# EAGLE design rolladen (EAGLE 6.3)
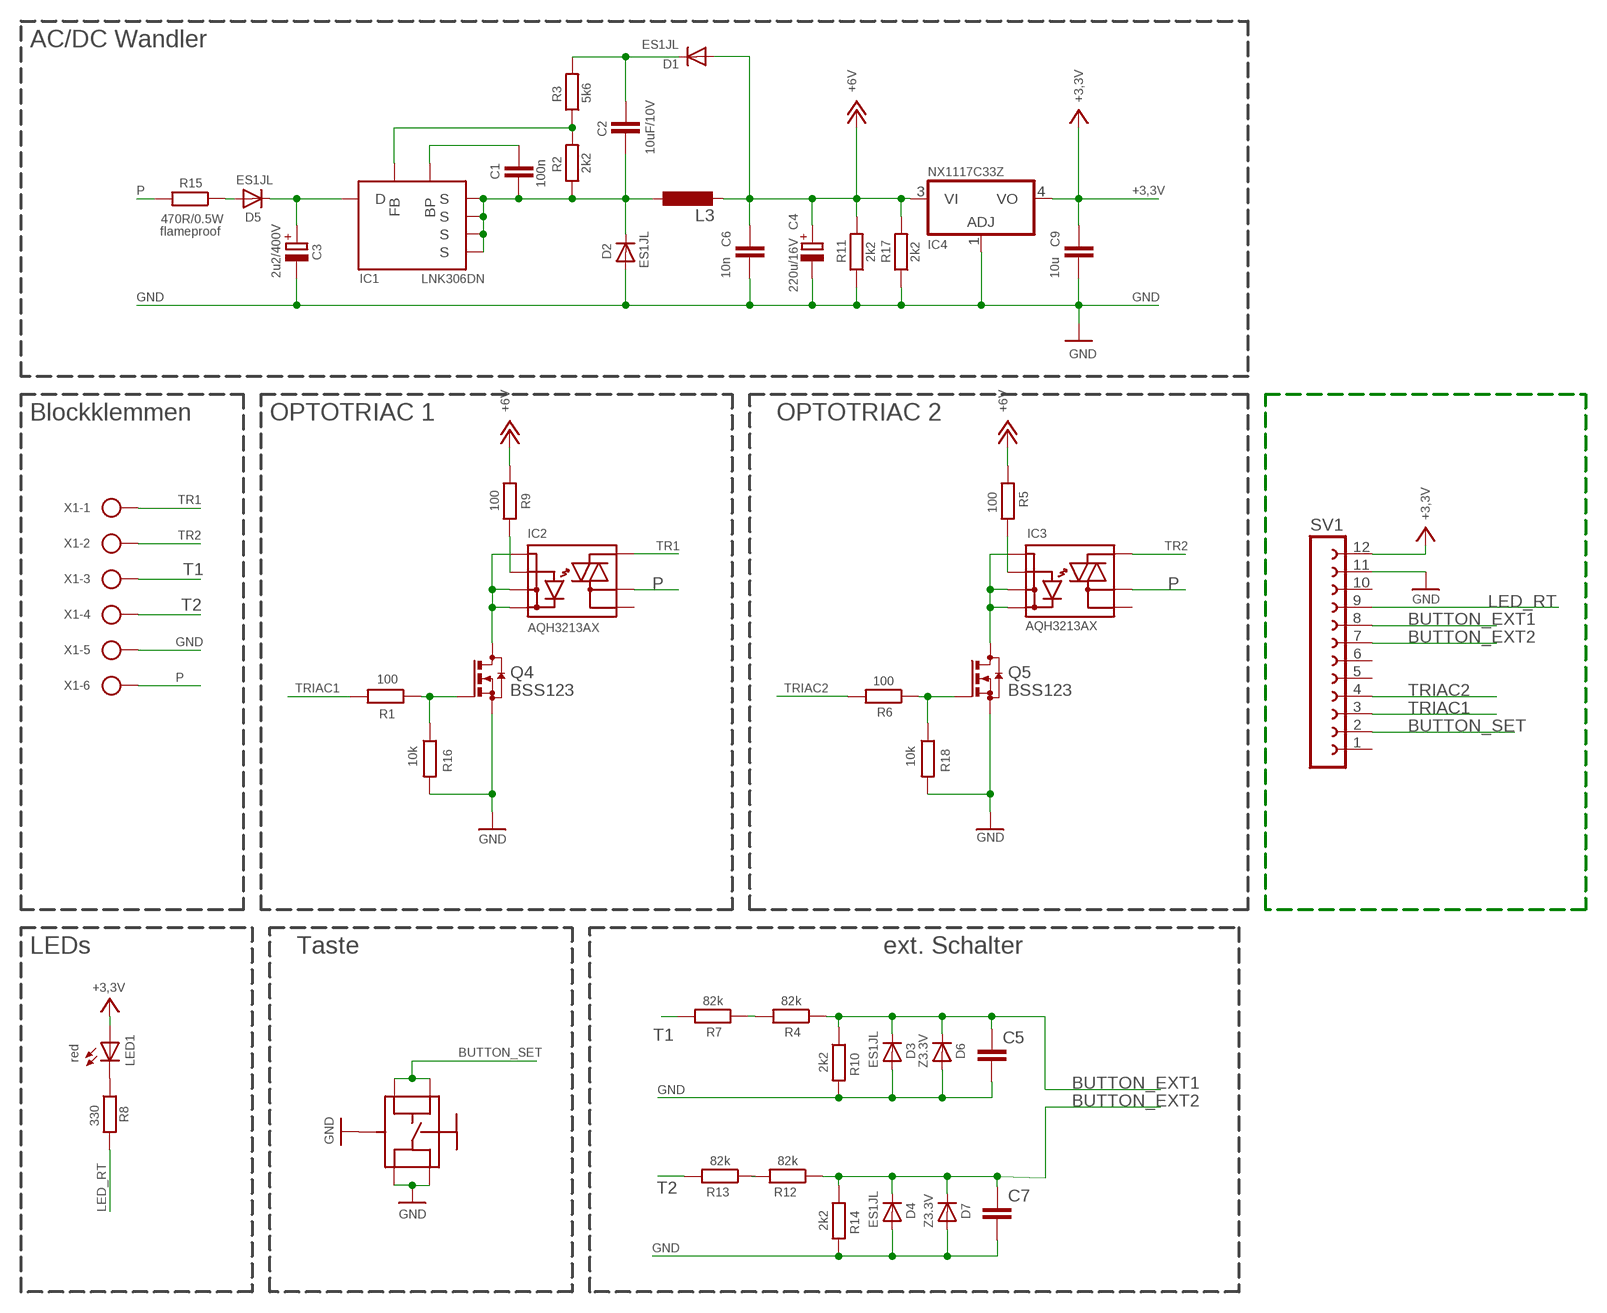
[diagram p0: schematic, sheet 1]

## Parts
C1  100n  C-EUC0603  [C0603]
C2  10uF/10V  C-EUC0805  [C0805]
C3  2u2/400V  CPOL-EUTT5D11L  [TT5D11L]
C4  220u/16V  CPOL-EU153CLV-0605  [153CLV-0605]
C5  C-EUC0603  [C0603]
C6  10n  C-EUC0603  [C0603]
C7  C-EUC0603  [C0603]
C9  10u  C-EUC0805  [C0805]
D1  ES1JL  DIODE-SOD323-W  [SOD323-W]
D2  ES1JL  DIODE-SOD323-W  [SOD323-W]
D3  ES1JL  DIODE-SOD323-W  [SOD323-W]
D4  ES1JL  DIODE-SOD323-W  [SOD323-W]
D5  ES1JL  DIODE-SOD323-W  [SOD323-W]
D6  Z3.3V  DIODE-SOD323-W  [SOD323-W]
D7  Z3.3V  DIODE-SOD323-W  [SOD323-W]
IC1  LNK306DN  LNK306  [SO-8C]
IC2  AQH3213AX  AQHRELAYS  [SO-08D]
IC3  AQH3213AX  AQHRELAYS  [SO-08D]
IC4  NX1117C33Z  317EMP  [SOT223]
L3  L-EUWE-TPC  [POWER-CHOKE_WE-TPC]
LED1  red  LEDCHIPLED_0603  [CHIPLED_0603]
Q4  BSS123  [SOT23]
Q5  BSS123  [SOT23]
R1  100  R-EU_R0603  [R0603]
R2  2k2  R-EU_R0603  [R0603]
R3  5k6  R-EU_R0603  [R0603]
R4  82k  R-EU_R0805  [R0805]
R5  100  R-EU_R0603  [R0603]
R6  100  R-EU_R0603  [R0603]
R7  82k  R-EU_R0805  [R0805]
R8  330  R-EU_R0603  [R0603]
R9  100  R-EU_R0603  [R0603]
R10  2k2  R-EU_R0603  [R0603]
R11  2k2  R-EU_R0603  [R0603]
R12  82k  R-EU_R0805  [R0805]
R13  82k  R-EU_R0805  [R0805]
R14  2k2  R-EU_R0603  [R0603]
R15  470R/0.5W  R-EU_0411/3V  [0411V]
R16  10k  R-EU_R0603  [R0603]
R17  2k2  R-EU_R0603  [R0603]
R18  10k  R-EU_R0603  [R0603]
S1  KMR  [KMR]
SV1  FE12-1  [FE12]
X1  W237-06P  [W237-6P]

## Nets
+3,3V: C9.1 IC4.4(VO) LED1.A SV1.12
+12V: C4.+ C6.1 D1.A IC4.3(VI) L3.2 R5.1 R9.1 R11.2 R17.2 ; supply symbol labelled +6V
BUTTON_EXT1: C5.1 D3.C D6.C R4.1 R10.1 SV1.8
BUTTON_EXT2: C7.1 D4.C D7.C R12.1 R14.1 SV1.7
BUTTON_SET: S1.P$2 S1.P$3 SV1.2
GND: C3.- C4.- C5.2 C6.2 C7.2 C9.2 D2.A D3.A D4.A D6.A D7.A IC4.1(ADJ) Q4.2(S) Q5.2(S) R10.2 R11.1 R14.2 R16.2 R17.1 R18.2 S1.P$1 S1.P$4 S1.P$5 SV1.11 X1.5
LED_RT: R8.2 SV1.9
N$1: IC1.P$2(FB) R2.2 R3.1
N$2: C1.1 IC1.P$1(BP)
N$3: C1.2 C2.2 D2.C IC1.P$4(S) IC1.P$5(S) IC1.P$6(S) IC1.P$7(S) L3.1 R2.1
N$4: C2.1 D1.C R3.2
N$6: D5.A R15.1
N$7: IC2.P$1 IC2.P$3 IC2.P$4 Q4.3(D)
N$8: R4.2 R7.1
N$10: Q4.1(G) R1.1 R16.1
N$11: IC3.P$2 R5.2
N$12: IC3.P$1 IC3.P$3 IC3.P$4 Q5.3(D)
N$14: LED1.C R8.1
N$16: Q5.1(G) R6.1 R18.1
N$18: R12.2 R13.1
N$21: IC2.P$2 R9.2
N$24: C3.+ D5.C IC1.P$3(D)
P: IC2.P$6 IC3.P$6 R15.2 X1.6
T1: R7.2 X1.3
T2: R13.2 X1.4
TR1: IC2.P$7 X1.1
TR2: IC3.P$7 X1.2
TRIAC1: R1.2 SV1.3
TRIAC2: R6.2 SV1.4
Unconnected: IC2.P$5 IC3.P$5 SV1.1 SV1.5 SV1.6 SV1.10

## Notes on the sheet
- AC/DC Wandler
- flameproof
- Blockklemmen | OPTOTRIAC 1 | OPTOTRIAC 2
- LEDs | Taste | ext. Schalter

## Library data of the parts
C1 C2 C5-C7 C9 = rcl:C-EU: CAPACITOR, European symbol
C3 C4 = rcl:CPOL-EU: POLARIZED CAPACITOR, European symbol
D1-D7 = diode standard:DIODE-: DIODE
IC1 = 2CR:LNK306
IC2 IC3 = 2CR:AQHRELAYS
IC4 = linear:*317: Positive VOLTAGE REGULATOR
L3 = rcl:L-EU: INDUCTOR, European symbol
LED1 = led:LED: LED OSRAM: - CHIPLED LG R971, LG N971, LY N971, LG Q971, LY Q971, LO R971, LY R971 LH N974, LH R974 LS Q976, LO Q976, LY Q976 LO Q996 - Hyper CHIPLED LW Q18S LB Q993, LB Q99A, LB R99A - SideLED LS A670, LO A670, LY A670, LG A670, LP A670 LB A673, LV A673, LT A673, LW A673 LH A674 LY A675 LS A676, LA A676, LO A676, LY A676, LW A676 LS A679, LY A679, LG A679 - Hyper Micro SIDELED® LS Y876, LA Y876, LO Y876, LY Y876 LT Y87S - SmartLED LW L88C, LW L88S LB L89C, LB L89S, LG L890 LS L89K, LO L89K, LY L89K LS L896, LA L896, LO L896, LY L896 - TOPLED LS T670, LO T670, LY T670, LG T670, LP T670 LSG T670, LSP T670, LSY T670, LOP T670, LYG T670 LG T671, LOG T671, LSG T671 LB T673, LV T673, LT T673, LW T673 LH T674 LS T676, LA T676, LO T676, LY T676, LB T676, LH T676, LSB T676, LW T676 LB T67C, LV T67C, LT T67C, LS T67K, LO T67K, LY T67K, LW E67C LS E67B, LA E67B, LO E67B, LY E67B, LB E67C, LV E67C, LT E67C LW T67C LS T679, LY T679, LG T679 LS T770, LO T770, LY T770, LG T770, LP T770 LB T773, LV T773, LT T773, LW T773 LH T774 LS E675, LA E675, LY E675, LS T675 LS T776, LA T776, LO T776, LY T776, LB T776 LHGB T686 LT T68C, LB T68C - Hyper Mini TOPLED® LB M676 - Mini TOPLED Santana® LG M470 LS M47K, LO M47K, LY M47K Source: http://www.osram.convergy.de LUXEON: - LUMILED® LXK2-PW12-R00, LXK2-PW12-S00, LXK2-PW14-U00, LXK2-PW14-V00 LXK2-PM12-R00, LXK2-PM12-S00, LXK2-PM14-U00 LXK2-PE12-Q00, LXK2-PE12-R00, LXK2-PE12-S00, LXK2-PE14-T00, LXK2-PE14-U00 LXK2-PB12-K00, LXK2-PB12-L00, LXK2-PB12-M00, LXK2-PB14-N00, LXK2-PB14-P00, LXK2-PB14-Q00 LXK2-PR12-L00, LXK2-PR12-M00, LXK2-PR14-Q00, LXK2-PR14-R00 LXK2-PD12-Q00, LXK2-PD12-R00, LXK2-PD12-S00 LXK2-PH12-R00, LXK2-PH12-S00 LXK2-PL12-P00, LXK2-PL12-Q00, LXK2-PL12-R00 Source: www.luxeon.com KINGBRIGHT: KA-3528ASYC Source: www.kingbright.com
Q4 Q5 = transistor-small-signal:BSS123: N-CHANNEL MOS FET
R1-R18 = rcl:R-EU_: RESISTOR, European symbol
S1 = 2CR:KMR
SV1 = con-lsta:FE12-1: FEMALE HEADER; OC_FARNELL: unknown; OC_NEWARK: unknown
X1 = con-wago-508:W237-06P: WAGO SREW CLAMP

## Board
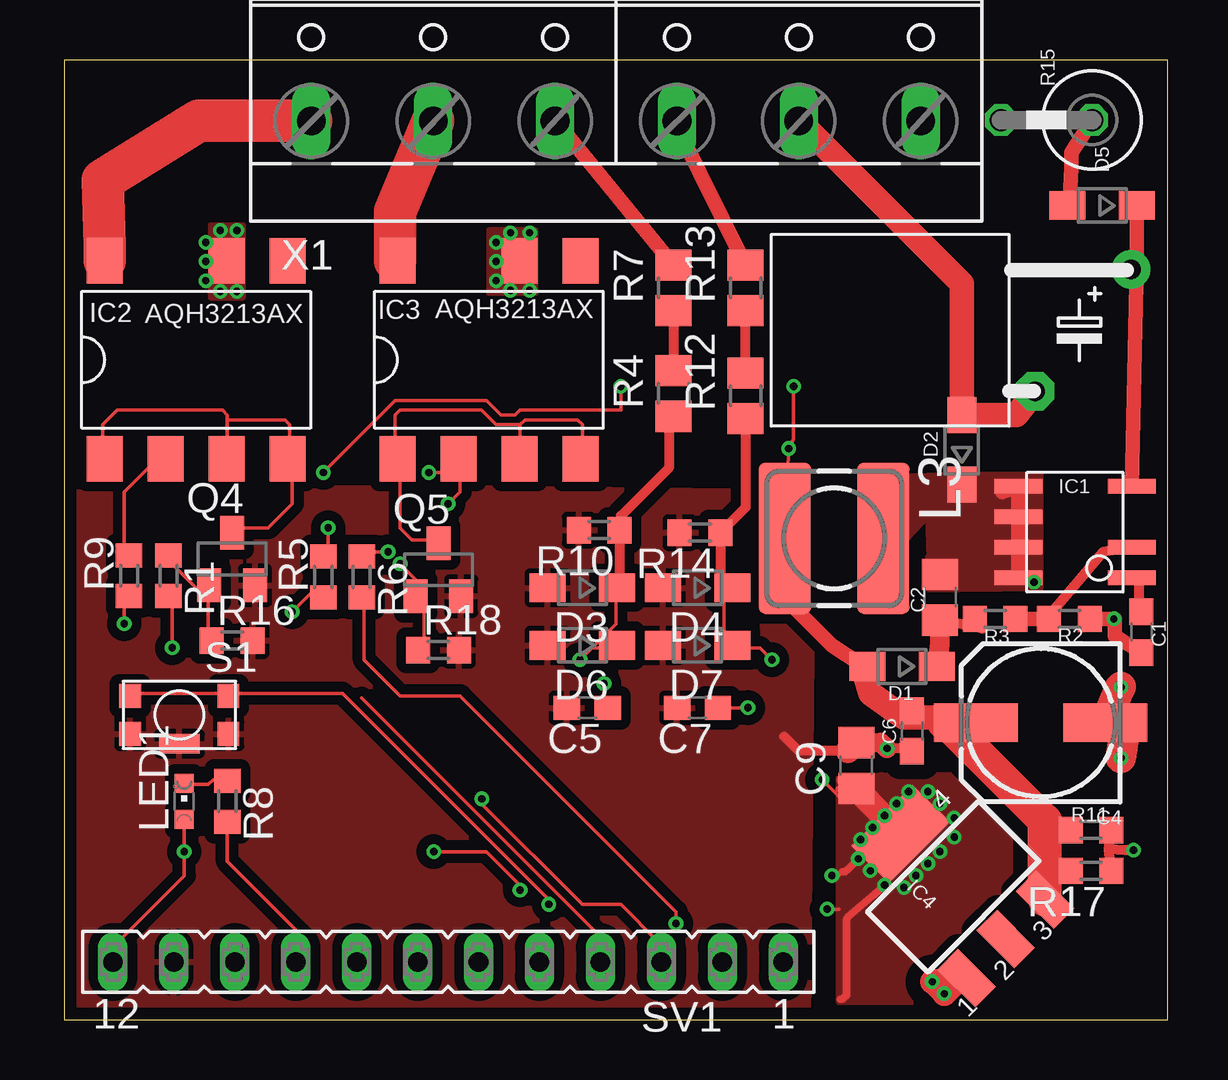
[diagram p1: board, top side]
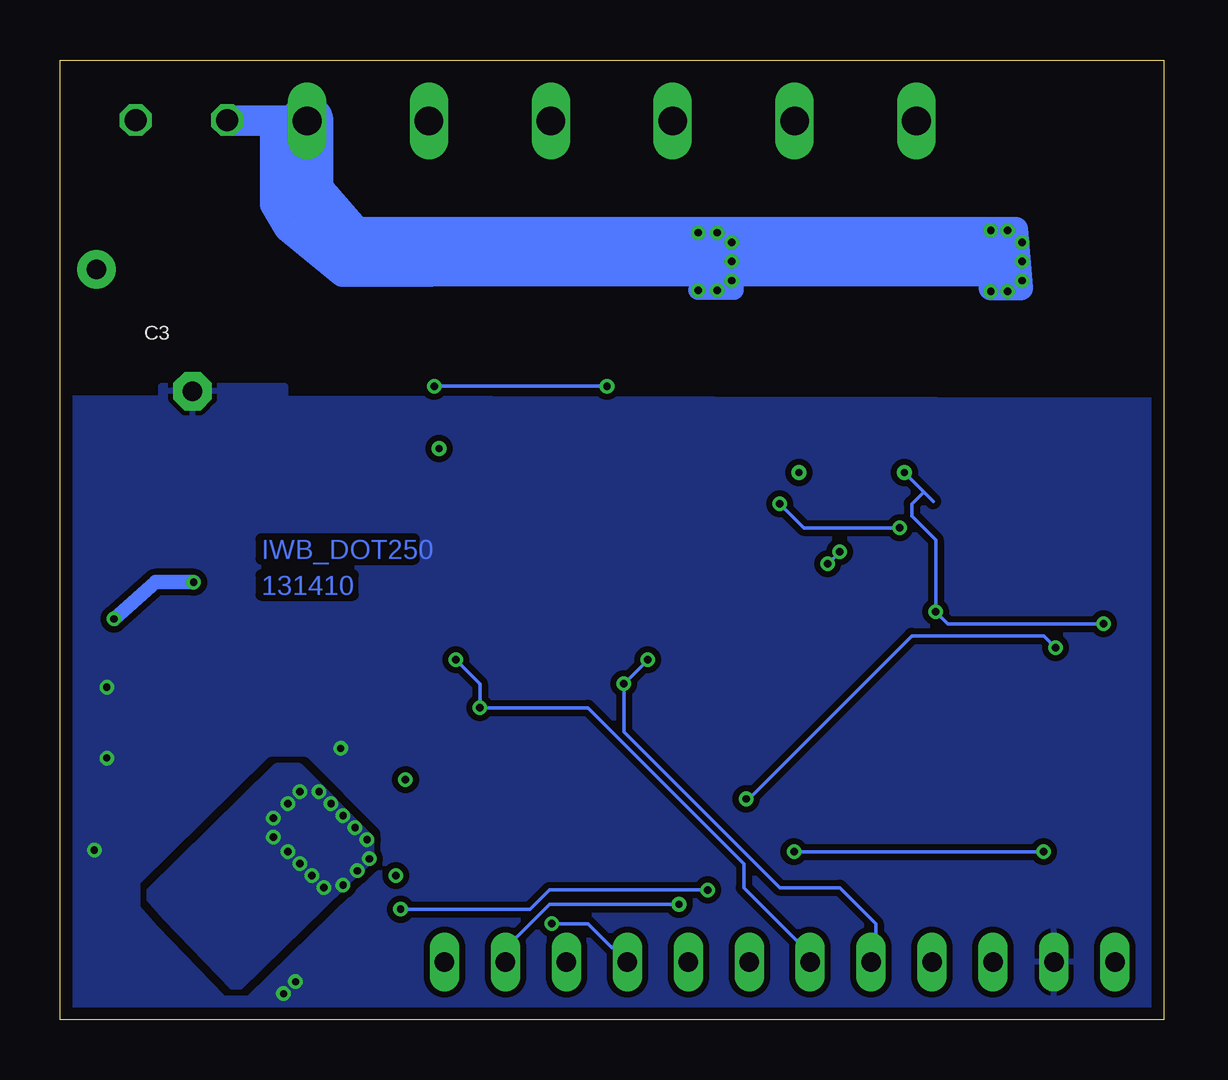
[diagram p2: board, bottom side, seen from below]

Size 46 x 40 mm. Coordinates in mm from the lower left corner, seen from the top.
Outline: 46,40 0,40 0,0 46,0 46,40
Copper layers (1*16): Top 0.035mm / dielectric 1.5mm / Bottom 0.035mm
Design rules "PCB-POOL": minimum track width 6mil, minimum drill 12mil, track to track 6mil, track to pad 6mil, pad to pad 6mil, via to via 6mil, smd to smd 6mil, copper to edge 20mil, drill to drill 8mil, minimum pad ring 8mil, minimum via ring 6mil, stop-mask expansion 3mil, vias tented up to drill 0mil, thermal gap 8mil

### Footprints (pad centres in the part's own frame; a part is rotated, then mirrored left to right if it is on the bottom)
C0603 = smd 1.1 x 1: 1 -0.85,0; 2 0.85,0
C0805 = smd 1.3 x 1.5: 1 -0.95,0; 2 0.95,0
TT5D11L = drill 0.813 pad 1.6: + 2.54,0 | drill 0.813 pad 1.6 octagon: - -2.54,4
153CLV-0605 = smd 3.5 x 1.6: + 2.7,0; - -2.7,0
SOD323-W = smd 1.5 x 1.2: A 1.45,0; C -1.45,0
SO-8C = smd 0.6 x 2: P$1 -1.905,-2.354; P$2 -0.635,-2.354; P$3 1.905,-2.354; P$4 1.905,2.354; P$5 0.635,2.354; P$6 -0.635,2.354; P$7 -1.905,2.354
SO-08D = smd 1.9 x 1.5: P$1 -4.128,3.81; P$2 -4.128,1.27; P$3 -4.128,-1.27; P$4 -4.128,-3.81; P$5 4.128,-3.81; P$6 4.128,-1.27; P$7 4.128,3.81
SOT223 = smd 1.219 x 2.235: 1 -2.311,-3.099; 2 0,-3.099; 3 2.311,-3.099 | smd 3.6 x 2.2: 4 0,3.099
POWER-CHOKE_WE-TPC = smd 6.3 x 2.2: 1 0,2.05; 2 0,-2.05
CHIPLED_0603 = smd 0.8 x 0.8: A 0,-0.75; C 0,0.75
SOT23 = smd 1 x 1.4: 1 -0.95,-1.1; 2 0.95,-1.1; 3 0,1.1
R0603 = smd 1 x 1.1: 1 -0.85,0; 2 0.85,0
R0805 = smd 1.3 x 1.5: 1 -0.95,0; 2 0.95,0
0411V = drill 0.914 octagon: 1 -2.54,0; 2 1.27,0
KMR = smd 0.9 x 1: P$1 0,0; P$2 0,-1.6; P$3 -4.1,-1.6; P$4 -4.1,0 | smd 1.7 x 0.8: P$5 -2.05,0.4
FE12 = drill 0.813 long: 1 -13.97,0; 2 -11.43,0; 3 -8.89,0; 4 -6.35,0; 5 -3.81,0; 6 -1.27,0; 7 1.27,0; 8 3.81,0; 9 6.35,0; 10 8.89,0; 11 11.43,0; 12 13.97,0
W237-6P = drill 1.194 long: 1 -12.7,-0.635; 2 -7.62,-0.635; 3 -2.54,-0.635; 4 2.54,-0.635; 5 7.62,-0.635; 6 12.7,-0.635

### Placement (x,y rotation side)
C1  44.9,16.15 270 top
C2  36.51,17.6 90 top
C3  44.48,28.73 90 top
C4  40.71,12.37 180 top
C5  21.8,13 180 top
C6  35.34,12.03 270 top
C7  26.4,13 180 top
C9  33.01,10.59 90 top
D1  34.92,14.72 180 top
D2  37.41,23.75 90 top
D3  21.6,18 180 top
D4  26.4,18 180 top
D5  43.27,33.93 180 top
D6  21.6,15.6 180 top
D7  26.4,15.6 180 top
IC1  42.13,20.32 90 top
IC2  5.5,27.5 90 top
IC3  17.7,27.5 90 top
IC4  37.05,5.55 45 top
L3  32.09,20.06 270 top
LED1  5,9.1 0 top
Q4  7,19.2 0 top
Q5  15.6,18.75 0 top
R1  4.35,18.5 270 top
R2  41.9,16.7 180 top
R3  38.8,16.7 180 top
R4  25.4,26.1 90 top
R5  10.8,18.45 90 top
R6  12.4,18.45 270 top
R7  25.4,30.5 90 top
R8  6.8,9.1 270 top
R9  2.7,18.5 90 top
R10  22.3,20.4 180 top
R11  42.8,7.9 180 top
R12  28.4,26 90 top
R13  28.4,30.5 90 top
R14  26.5,20.3 180 top
R15  40.31,37.5 180 top
R16  7,15.8 0 top
R17  42.8,6.2 180 top
R18  15.6,15.4 0 top
S1  2.75,11.9 180 top
SV1  16,2.4 180 top
X1  23,38.1 0 top

### Tracks (layer width: path | path; a pad name or v marks a point on that pad's centre or on a via)
+3,3V  (via drill 0.3)
  Top 0.152: v31.6,10 32.4,9.2 C9.1 | 32.4,0.8 32.39,0.85 | 32.3,6 v32,6 | LED1.A v5,7 5,6 2.2,3.2 2.2,2.4 SV1.12 | v15.4,7 17.6,7 19,5.6 v19,5.4 | 32.3,4.6 v31.8,4.6
  Top 0.254: 32.26,9.6 arc45 32.7,9.79 32.71,9.79
  Top 0.305: 32.45,6.15 arc45 32.62,6.22 v33.1,6.7 | 32.34,0.85 arc10 32.39,0.85 arc35 32.52,0.92 32.6,1 32.6,4.09 arc-45 32.67,4.27 v34.2,5.6
  Top 0.61: 32.5,10 32.71,9.79 C9.1
  Top 1.016: C9.1 34.21,8.39 IC4.4
  Bottom 0.152: v15.4,7 v5,7 | v19,5.4 25.6,5.4 26.4,4.6 v31.8,4.6
  other vias: 33.7,8 33.2,7.5 34.7,9 35.2,9.5 36,9.5 36.5,9 37.1,8.4 33.6,6.2 35,5.5 35.5,6 36,6.5 36.5,7 37.1,7.6 34.2,8.5
  pour Top (isolate 0.61, no thermals): 37.8,0.7 32.3,0.7 32.3,10.2 45.3,10.2 45.3,8.3
  pour Bottom (isolate 0.406, no thermals): 36.9,10.4 36.1,10.4 33.2,7.5 33.2,6.7 34.3,5.7 38.65,1.45 41.45,4.35 42.2,5.2
+12V  (via drill 0.3)
  Top 0.152: 33.38,14.52 33,14.5 D1.A 33.2,14.8 | 30,17.6 30,20 L3.2 30,20.4 v30.2,23.8 30.4,24.2 v30.4,26.4 | v10.8,22.8 13.8,25.8 17.6,25.8 18.2,25.2 18.8,25.2 19,25.4 23.2,25.4 v23.2,26.4 | v2.5,16.5 2.5,17.5 R9.1 | v9.5,17 10.5,18 R5.1
  Top 0.254: 33.39,14.49 D1.A
  Top 0.406: R11.2 41.18,7.7 40.88,8 | R17.2 40.98,6.4 40.88,6.5 | C6.1 35.14,12.46 35,12.6
  Top 0.61: 33.2,14.8 32,15.6 30,17.6
  Top 1.016: 36.68,12.37 36.45,12.6 35,12.6 33.6,13.6 33.4,14.29 D1.A 33.38,14.52
  Top 1.422: 36.68,12.37 36.8,12.37 | 36.8,12.37 C4.+ | IC4.3 40.88,6.5 40.88,8 40.88,8.29 36.8,12.37
  Bottom 0.152: v10.8,22.8 10,22 | 10,22 9.6,21.6 | v30.4,26.4 v23.2,26.4 | v2.5,16.5 9,16.5 v9.5,17 9.5,20 10.5,21 10.5,21.5 10,22
BUTTON_EXT1  (via drill 0.3)
  Top 0.152: 23.2,21 23.2,20.6 R10.1 | v22.5,14 22.5,13 C5.1 | 22,15.5 v21.5,15 | 22,15.5 23,15.5 D6.C | 22,15.5 23,16.5 23,18 D3.C
  Top 0.406: R4.1 25.2,25.15 25.2,23 23.2,21 | R10.1 23.15,18.1 D3.C
  Bottom 0.152: 12.2,3 SV1.8 12,2.5 12,4 13.5,5.5 16,5.5 22.5,12 v22.5,14 v21.5,15
BUTTON_EXT2  (via drill 0.3)
  Top 0.152: v28.5,13 C7.1 | v29.5,15 29,15.5 28,15.5 D7.C 27.5,16 27.5,18 D4.C
  Top 0.406: R12.1 28.4,21.35 R14.1 27.35,18.5 D4.C
  Bottom 0.152: 14.8,3.4 14.8,2.4 SV1.7 15,2.5 15,3 17.5,5.5 17.5,6.5 24,13 v28.5,13 28.5,14 v29.5,15
BUTTON_SET  (via drill 0.3)
  Top 0.152: 7,13.6 6.8,13.8 6.6,13.6 2.8,13.6 S1.P$2 | 7,13.6 11.6,13.6 20.2,5 v20.2,4.8 | 7,13.6 S1.P$3
  Bottom 0.152: v20.2,4.8 25.6,4.8 27.4,3 27.4,2.4 SV1.2
GND  (via drill 0.3)
  Top 0.406: R17.1 43.55,7.1 | 43.55,7.1 R11.1 | v44.57,7.06 44.21,7.06 43.55,7.1 | C6.2 35.12,11.31 v34.3,11.31 | 32.67,11.2 30.6,11.2 30,11.8
  Top 0.813: v34.3,11.31 34.03,11.56 C9.2
  Top 1.016: v36.68,1.08 37.33,1.72 IC4.1 | v36.18,1.58 36.22,1.58 36.7,1.1 37.2,1.6 | 37.3,1.7 37.2,1.6 | 37.2,1.6 36.2,1.6 | X1.5 37.41,30.68 D2.A 39.68,25.2 C3.- | 32.67,11.2 C9.2
  Top 1.27: C4.- 44.01,13.81 v44.05,13.86 | v44.05,10.91 44.25,12.3 44.4,12.45 44.35,12.45
  pour Bottom (isolate 0.254, rank 2): 0.2,25.8 46.5,25.9 46.2,-0.2 -0.5,-0.3
  pour Bottom: 36.6,23 36.6,26.4 41.8,26.4 41.8,23
  pour Top (isolate 0.406): 17.8,22.15 31.2,22 31,-0.2 0.5,0.1 0.4,0.9 0.2,22.2
LED_RT
  Top 0.152: R8.2 6.8,6.6 9.8,3.6 9.8,2.4 SV1.9
N$1
  Top 0.406: IC1.P$2 43.28,19.48 41.05,16.85 R2.2
  Top 0.61: R2.2 R3.1
N$2
  Top 0.152: 44.8,17.2 C1.1 | 44.8,18.4 IC1.P$1
  Top 0.406: 44.8,18.4 44.8,17.2
N$3  (via drill 0.3)
  Top 0.254: L3.1 34.02,20.16 34.27,20.16
  Top 0.406: IC1.P$7 v40.43,18.23
  Top 0.61: C1.2 43.8,16 43.8,16.7 v43.75,16.7 R2.1 | IC1.P$6 39.78,20.64 | IC1.P$7 IC1.P$6 | IC1.P$6 IC1.P$5 IC1.P$4 39.11,21.99
  Bottom 0.61: v40.43,18.23 42.02,18.23 v43.75,16.7
  pour Top (no thermals): 40.7,18 40.7,22.7 37,22.7 35.95,22.65 34.27,22.6 34.27,19.14 36,21 36.06,19.2 36,19.29 36,17.95 37.3,17.95 38.65,17.97 39.07,17.97 39.12,18
N$4
  Top 0.406: R3.2 38.25,16.3 C2.1
  Top 0.813: D1.C 36.51,15.66 C2.1
N$6
  Top 0.254: 41.91,34.29 D5.A
  Top 0.61: 41.91,34.29 41.98,35.49 41.98,36.13 R15.1
N$7
  Top 0.152: 6.8,25 6.8,23.4 IC2.P$3 | 6.8,25 6.8,25.2 6.6,25.4 2.2,25.4 1.6,24.8 1.6,23.4 IC2.P$1 | 6.8,25 9.2,25 9.4,24.8 9.4,23.4 IC2.P$4 9.5,23 9.5,21.5 8.5,20.5 7,20.5 Q4.3
N$8
  Top 0.406: R7.1 R4.2
N$10
  Top 0.152: 6,17.5 6,18 Q4.1 6,17.5 | 6,17.5 6,16 R16.1 | 6,17.5 4.5,19 R1.1
N$11  (via drill 0.3)
  Top 0.152: v15.2,22.8 16.4,22.8 16.4,23.2 IC3.P$2 16.5,23 16.5,22 v16,21.5 | v11,20.5 11,19.5 R5.2
  Bottom 0.152: v11,20.5 15,20.5 v16,21.5
N$12
  Top 0.152: 19,24.8 19,23.4 IC3.P$3 | 19,24.8 19.2,25 21.4,25 21.6,24.8 21.6,23.4 IC3.P$4 | 13.8,23.2 IC3.P$1 | 19,24.8 18,24.8 17.4,25.4 14,25.4 13.8,25.2 13.8,23.4 IC3.P$1 | Q5.3 15.5,20 14.5,20 14,20.5 14,23 IC3.P$1
N$14
  Top 0.152: LED1.C 5,9.8 6,9.8 6.2,10 6.8,10 R8.1
N$16  (via drill 0.3)
  Top 0.152: R18.1 15,15.5 15,17.5 Q5.1 15,18 v14,19 | v13.5,19.5 12.5,19.5 R6.1
  Bottom 0.152: v14,19 v13.5,19.5
N$18
  Top 0.406: R12.2 R13.1
N$21
  Top 0.152: R9.2 2.5,19.5 2.5,22 3.5,23 4,22.5 4.5,23 IC2.P$2
N$24
  Top 0.254: 44.45,34.29 D5.C
  Top 0.61: D5.C 44.72,30.67 C3.+ 44.69,30.67 IC1.P$3
P  (via drill 0.3)
  Bottom 0.152: v6.5,32.9 6.4,33.2 6.15,32.95
  Bottom 0.254: 9.97,31.63 v7.2,32.9
  Bottom 0.61: 39.06,37.47 R15.2
  Bottom 0.813: v19.4,30.4 17.9,30.4 17.9,30.7 | v19.4,32.8 28.45,32.8 29.6,31.65
  Bottom 1.016: 37.16,37.47 37.16,33.97 36.55,32.95 | 36.55,32.95 6.15,32.95 5.95,30.5 7.2,30.5 7.2,30.8 | 30.45,31.65 30.55,31.05 34.25,31.05 36.55,32.95
  Bottom 1.27: X1.6 37.16,37.47 39.06,37.47
  Bottom 1.422: 7.13,31.65 7.11,31.53
  Bottom 1.93: 35.8,37.37 X1.6
  Bottom 2.184: X1.6 35.7,34.5 33.25,31.65 30.45,31.65 29.6,31.65 7.13,31.65
  other vias: 18.6,32.8 18,32.4 18,31.6 18.6,30.4 5.9,30.8 7.2,30.35 6.5,30.35 5.9,31.6 5.9,32.4 18,30.8
  pour Top (no thermals): 6.1,30.1 7.45,30.1 7.45,33.1 6.1,33.1
  pour Top (no thermals): 17.7,30.3 19.65,30.3 19.65,32.9 17.7,32.9
T1
  Top 0.61: 20.46,37.49 R7.2
  Top 1.016: X1.3 20.46,37.49
T2
  Top 0.61: 25.54,37.21 R13.2
  Top 1.016: X1.4 25.54,37.21
TR1
  Top 1.778: IC2.P$7 1.69,32.29 1.6,35 5.6,37.47 X1.1
TR2
  Top 1.016: IC3.P$7 13.8,31.63
  Top 1.778: 13.8,31.63 13.8,33.69 X1.2
TRIAC1  (via drill 0.3)
  Top 0.152: v17.4,9.2 17.4,9 21.6,4.8 23.2,4.8 24.8,3.2 24.8,2.4 SV1.3 | v4.5,15.5 4.5,17.5 R1.2
  Bottom 0.152: v4.5,15.5 5,16 10.5,16 17.5,9 v17.4,9.2
TRIAC2  (via drill 0.3)
  Top 0.152: 12.4,13.4 22.2,3.6 22.2,2.4 SV1.4 | v25.5,4 25.5,4.5 16.5,13.5 14,13.5 12.5,15 12.5,17.5 R6.2
  Bottom 0.152: v25.5,4 24,4 23,3 22.5,3 22,2.5 SV1.4

### Text on the board
Bottom: IWB_DOT250 | 131410
Reference: Last | Last | N | N | N | P | Taste 1 | Taste 2
bLabel: Made in AUSTRIA | www.reder.eu | C:/Users/CR/Desktop/Reder_icon.bmp